# Altium project PCB_Project.PrjPcb
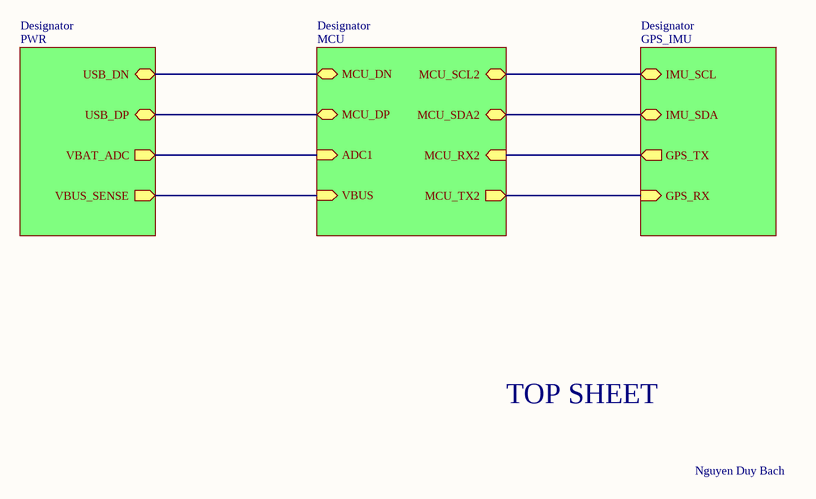
[diagram p0: Top.SchDoc]
4 sheets, 82 parts. Net scope: hierarchical (ports join the sheet entries above them; power ports are global).
Board file: Top.PcbDoc
Sheets:
  Top.SchDoc
    Designator = PWR.SchDoc
    Designator = MCU.SchDoc
    Designator = GPS_IMU.SchDoc

## Sheet Top.SchDoc
size A; SheetNumber: 1; SheetTotal: 4

### Sub-sheets
Designator = PWR: VBAT_ADC (out), VBUS_SENSE (out), USB_DP (bidir), USB_DN (bidir)
Designator = MCU: MCU_DN (bidir), MCU_DP (bidir), ADC1 (in), VBUS (in), MCU_SDA2 (bidir), MCU_SCL2 (bidir), MCU_TX2 (out), MCU_RX2 (in)
Designator = GPS_IMU: IMU_SCL (bidir), IMU_SDA (bidir), GPS_TX (out), GPS_RX (in)

### Nets
IMU_SCL: sheet Designator/MCU_SCL2, sheet Designator/IMU_SCL
IMU_SDA: sheet Designator/MCU_SDA2, sheet Designator/IMU_SDA
IO_A1: sheet Designator/VBAT_ADC, sheet Designator/ADC1
IO_A9: sheet Designator/VBUS_SENSE, sheet Designator/VBUS
RX2: sheet Designator/MCU_RX2, sheet Designator/GPS_TX
TX2: sheet Designator/MCU_TX2, sheet Designator/GPS_RX
USB_D_N: sheet Designator/USB_DN, sheet Designator/MCU_DN
USB_D_P: sheet Designator/USB_DP, sheet Designator/MCU_DP

### Notes on the sheet
- TOP SHEET
- Nguyen Duy Bach

## Sheet PWR.SchDoc
size A; SheetNumber: 4; SheetTotal: 4
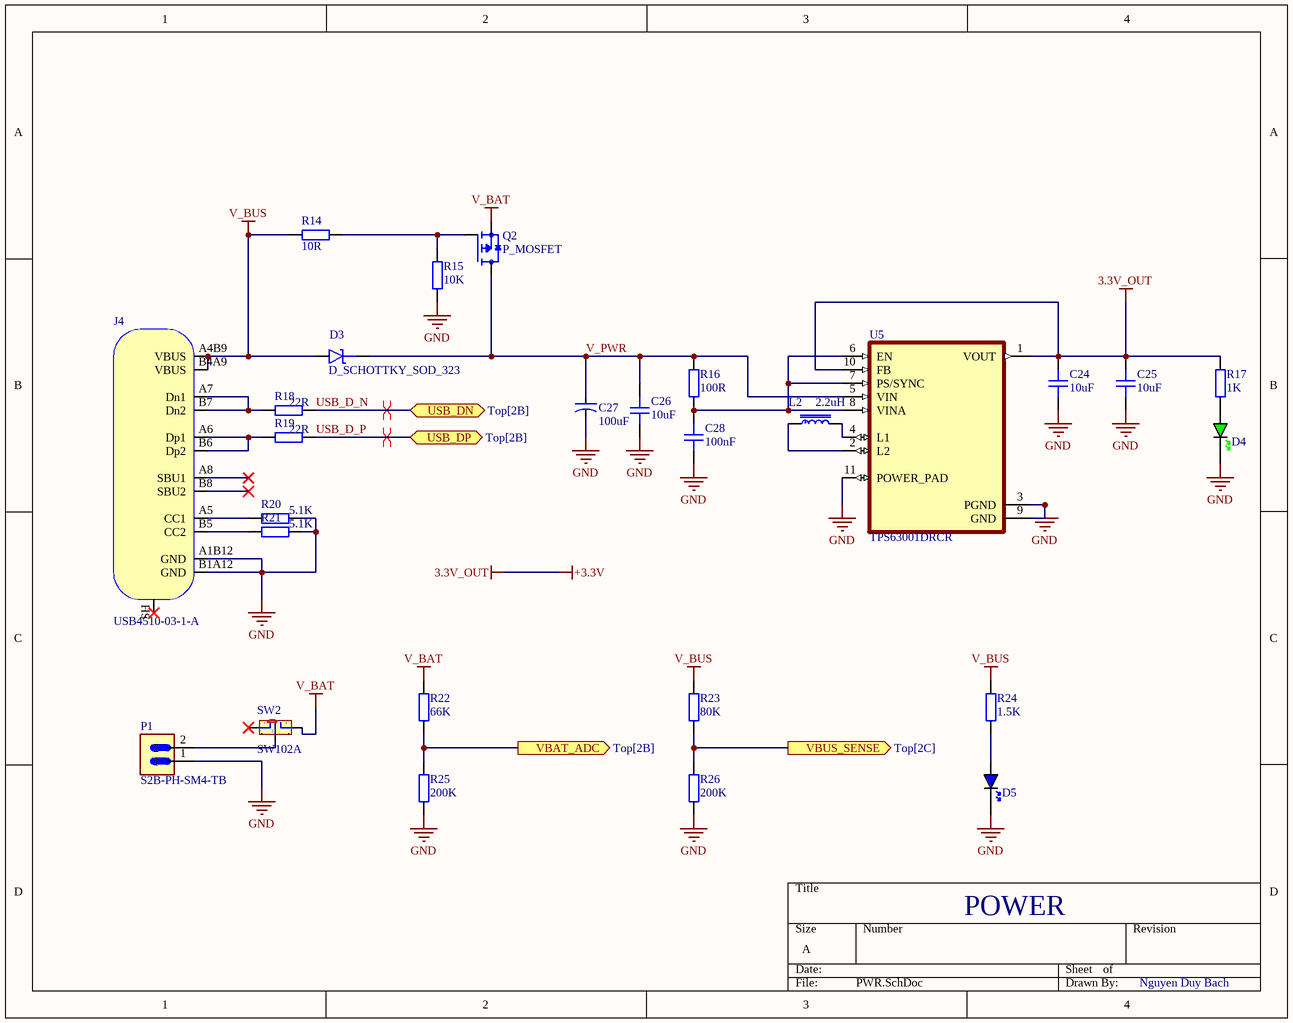
[diagram p1: PWR.SchDoc]

### Parts
C24  10uF  [CAP_1206]
C25  10uF  [CAP_1206]
C26  10uF  [CAP_1206]
C27  100uF  [CAP-ALU-SMD-6.3x7.7x2.2]
C28  100nF  [CAP_0603]
D3  D_SCHOTTKY_SOD_323  [SOD-323]
D4  GREEN  [LED_0805_GREEN]  (value not drawn)
D5  BLUE  [LED_0805_BLUE]  (value not drawn)
J4  USB4510-03-1-A  [USB4510-03-1-A]
L2  2.2uH  [INDC6060X300]
P1  S2B-PH-SM4-TB  [JST_S2B-PH-SM4-TB]
Q2  P_MOSFET  [P_MOSFET_SOT23]
R14  10R  [RES_0603]
R15  10K  [RES_0603]
R16  100R  [RES_1206]
R17  1K  [RES_0805]
R18  22R  [RES_0603]
R19  22R  [RES_0603]
R20  5.1K  [RES_0603]
R21  5.1K  [RES_0603]
R22  66K  [RES_0603]
R23  80K  [RES_0603]
R24  1.5K  [RES_0805]
R25  200K  [RES_0603]
R26  200K  [RES_0603]
SW2  SW102A  [SW102]
U5  TPS63001DRCR  [VREG_V62/16624-01YE]

### Ports
USB_DN (bidir, see Top[2B]), USB_DP (bidir, see Top[2B]), VBAT_ADC (out, see Top[2B]), VBUS_SENSE (out, see Top[2C])

### Nets
+3.3V: C24.2 C25.2 R17.2 U5.1(VOUT) U5.10(FB)  [also labelled 3.3V_OUT]  [project net IMU_VIN]
GND: C24.1 C25.1 C26.1 C27.2 C28.1 D4.K D5.K J4.A1B12(GND) J4.B1A12(GND) P1.1 R15.1 R20.1 R21.1 R25.1 R26.1 U5.3(PGND) U5.9(GND) U5.11(POWER_PAD)
V_BAT: Q2.2(S) R22.2 SW2.3
V_BUS: D3.A J4.A4B9(VBUS) J4.B4A9(VBUS) R14.2 R23.2 R24.2
IO_A1: R22.1 R25.2 ; port VBAT_ADC
IO_A9: R23.1 R26.2 ; port VBUS_SENSE
USB_D_N: R18.1 ; port USB_DN
USB_D_P: R19.1 ; port USB_DP
V_PWR: C26.2 C27.1 D3.K Q2.3(D) R16.2 U5.5(VIN)
NetC28_2: C28.2 R16.1 U5.6(EN) U5.7(PS/SYNC) U5.8(VINA)
NetD4_A: D4.A R17.1
NetD5_A: D5.A R24.1
NetJ4_A5: J4.A5(CC1) R20.2
NetJ4_A6: J4.A6(Dp1) J4.B6(Dp2) R19.2
NetJ4_A7: J4.A7(Dn1) J4.B7(Dn2) R18.2
NetJ4_B5: J4.B5(CC2) R21.2
NetL2_1: L2.1 U5.2(L2)
NetL2_2: L2.2 U5.4(L1)
NetP1_2: P1.2 SW2.2
NetQ2_1: Q2.1(G) R14.1 R15.2

Not connected (* = marked no-connect by the designer): J4 A8(SBU1)* B8(SBU2)* SH(SHIELD)*; SW2 1* 4 5

### Layout directives
differential pair: USB_D_N, USB_D_P

### Notes on the sheet
- POWER
- Nguyen Duy Bach

### Library data of the parts
C24-C26 = CAP_1206: Capacitor SMD 1206; Manufacturer: *; Manufacturer Part Number: *; Distributor Link: *; LCSC: *; Rating: *; Dielectric: *
C27 = CN-ALU-SMD: Polarized Capacitor (Axial); Published: 8-Jun-2000; LatestRevisionDate: 17-Jul-2002; LatestRevisionNote: Re-released for DXP Platform.; PackageReference: POLAR0.8; Publisher: Altium Limited
C28 = CAP_0603: Capacitor SMD 0603; Manufacturer: *; Manufacturer Part Number: *; Distributor Link: *; LCSC: *; Rating: *; Dielectric: *
D3 = D_SCHOTTKY_SOD_323: Diode Schottky SMD SOD-323
D4 = LED_0805_GREEN: LED 0805 GREEN SMD; Manufacturer: *; Manufacturer Part Number: *; Distributor Link: *; LCSC: *
D5 = LED_0805_BLUE: LED 0805 BLUE SMD; Manufacturer: *; Manufacturer Part Number: *; Distributor Link: *; LCSC: *
J4 = USB4510-03-1-A: USB Connector Type C SMT Mid-Mount 16 Pin; Manufacturer: GCT; Manufacturer Part Number: USB4510-03-1-A
L2 = CSAB0630-100M: SMD Inductor 10uH-20%-5A; MF: Codaca; SnapEDA_Link: https://www.snapeda.com/parts/CSAB0630-100M/Codaca/view-part/?ref=snap; Package: None; Value: *; MP: CSAB0630-100M; Check_prices: https://www.snapeda.com/parts/CSAB0630-100M/Codaca/view-part/?ref=eda
P1 = S2B-PH-SM4-TB: Connector Header Surface Mount, Right Angle 2 position 0.079 (2.00mm); MF: JST Sales; SnapEDA_Link: https://www.snapeda.com/parts/S2B-PH-SM4-TB/JST/view-part/?ref=snap; Package: None; Value: *; MP: S2B-PH-SM4-TB; Check_prices: https://www.snapeda.com/parts/S2B-PH-SM4-TB/JST/view-part/?ref=eda
Q2 = P_MOSFET: MOSFET, SOT-23, P, -30V, -4A, 0.065â„¦, 150Â°C; MF: Diotec Semiconductor; MP: MMFTP3401; SnapEDA_Link: https://www.snapeda.com/parts/MMFTP3401/Diotec/view-part/?ref=snap; Package: SOT-23 Diotec; Value: *; Check_prices: https://www.snapeda.com/parts/MMFTP3401/Diotec/view-part/?ref=eda
R14 R15 R18-R23 R25 R26 = RES_0603: Resistor SMD 0603; Manufacturer: *; Manufacturer Part Number: *; Distributor Link: *; LCSC: *
R16 = RES_1206: Resistor SMD 1206; Manufacturer: *; Manufacturer Part Number: *; Distributor Link: *; LCSC: *
R17 R24 = RES_0805: Resistor SMD 0805; Manufacturer: *; Manufacturer Part Number: *; Distributor Link: *; LCSC: *
SW2 = SW102A: Switch 102 on Broad; Value: Switch 102 On Board
U5 = TPS63001DRCR: 96% Buck-Boost Converter with 1.7A Current Switches, 3.3V fixed Output voltage in 3x3 QFN; MF: Texas Instruments; SnapEDA_Link: https://www.snapeda.com/parts/TPS63001DRCR/Texas+Instruments/view-part/?ref=snap; Package: VSON-10 Texas Instruments; Value: *; MP: TPS63001DRCR; Check_prices: https://www.snapeda.com/parts/TPS63001DRCR/Texas+Instruments/view-part/?ref=eda

## Sheet MCU.SchDoc
size A; SheetNumber: 2; SheetTotal: 4
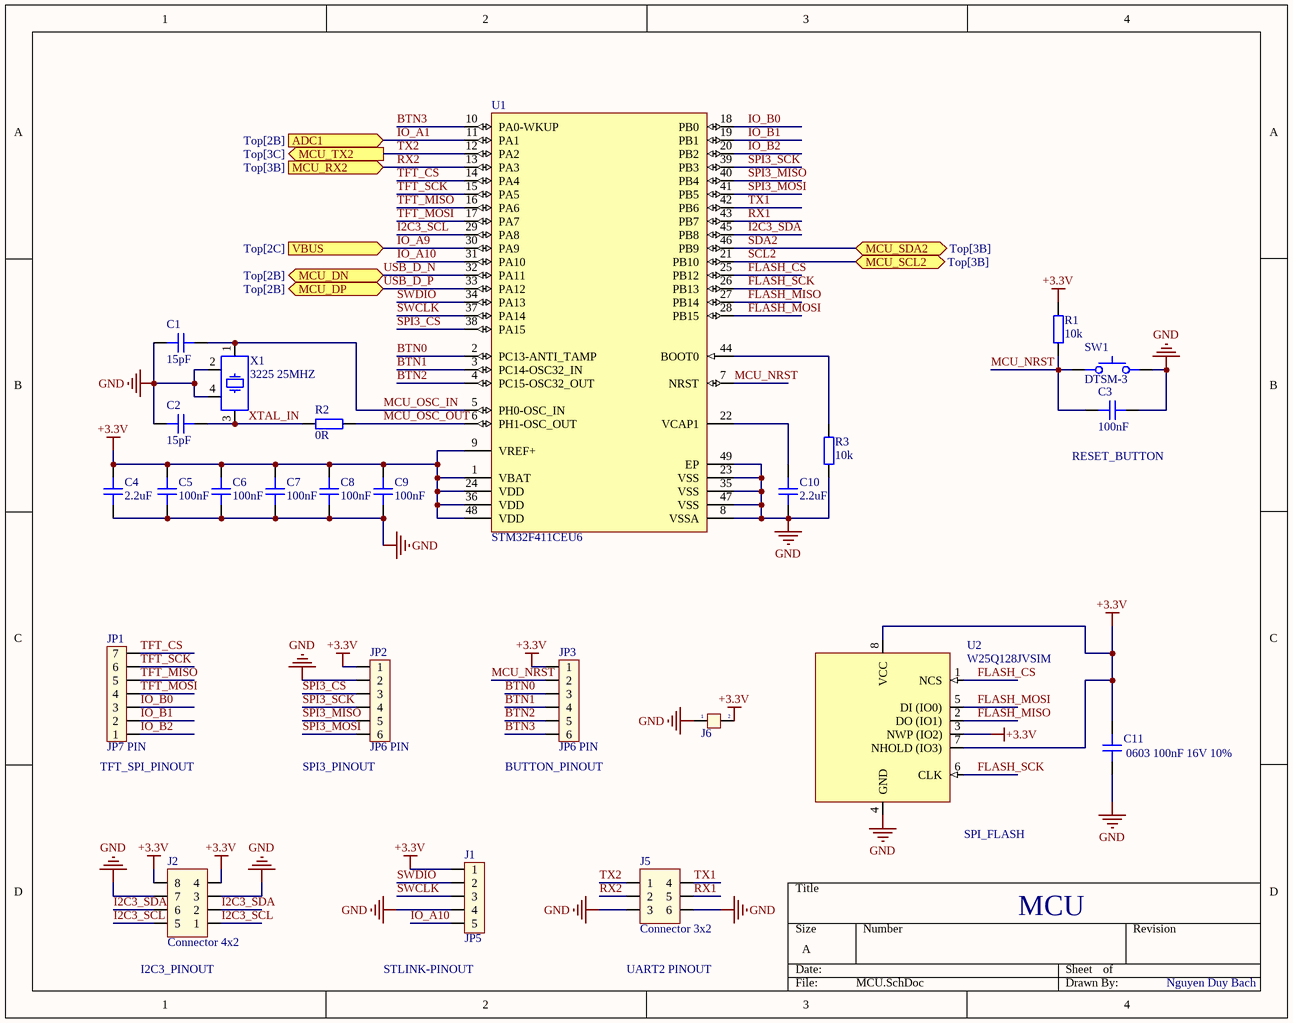
[diagram p2: MCU.SchDoc]

### Parts
C1  15pF  [CAP_0603]
C2  15pF  [CAP_0603]
C3  100nF  [CAP_0603]
C4  2.2uF  [CAP_0805]
C5  100nF  [CAP_0603]
C6  100nF  [CAP_0603]
C7  100nF  [CAP_0603]
C8  100nF  [CAP_0603]
C9  100nF  [CAP_0603]
C10  2.2uF  [CAP_0805]
C11  0603 100nF 16V 10%  [CAP_0603]
J1  JP5  [JP5]
J2  Connector 4x2  [JP4x2]
J5  Connector 3x2  [JP3x2]
J6  Jumper 2  [JP2]  (value not drawn)
JP1  JP7 PIN  [JP7]
JP2  JP6 PIN  [JP6]
JP3  JP6 PIN  [JP6]
R1  10k  [RES_0603]
R2  0R  [RES_0603]
R3  10k  [RES_0603]
SW1  DTSM-3  [DTSM-3]
U1  STM32F411CEU6  [STM-UFQFPN48_L]
U2  W25Q128JVSIM  [SOIC-8]
X1  3225 25MHZ  [XTAL_3225]

### Ports
ADC1 (in, see Top[2B]), MCU_DN (bidir, see Top[2B]), MCU_DP (bidir, see Top[2B]), MCU_RX2 (in, see Top[3B]), MCU_SCL2 (bidir, see Top[3B]), MCU_SDA2 (bidir, see Top[3B]), MCU_TX2 (out, see Top[3C]), VBUS (in, see Top[2C])

### Nets
+3.3V: C4.2 C5.2 C6.2 C7.2 C8.2 C9.2 C11.2 J1.1 J2.4 J2.8 J6.2 JP2.1 JP3.1 R1.2 U1.1(VBAT) U1.9(VREF+) U1.24(VDD) U1.36(VDD) U1.48(VDD) U2.3(NWP_(IO2)) U2.7(NHOLD_(IO3)) U2.8(VCC)  [project net IMU_VIN]
GND: C1.2 C2.2 C3.1 C4.1 C5.1 C6.1 C7.1 C8.1 C9.1 C10.1 C11.1 J1.4 J2.3 J2.7 J5.3 J5.6 J6.1 JP2.2 R3.1 SW1.2 U1.8(VSSA) U1.23(VSS) U1.35(VSS) U1.47(VSS) U1.49(EP) U2.4(GND) X1.2 X1.4
BTN0: JP3.3 U1.2(PC13-ANTI_TAMP)
BTN1: JP3.4 U1.3(PC14-OSC32_IN)
BTN2: JP3.5 U1.4(PC15-OSC32_OUT)
BTN3: JP3.6 U1.10(PA0-WKUP)
FLASH_CS: U1.25(PB12) U2.1(NCS)
FLASH_MISO: U1.27(PB14) U2.2(DO_(IO1))
FLASH_MOSI: U1.28(PB15) U2.5(DI_(IO0))
FLASH_SCK: U1.26(PB13) U2.6(CLK)
I2C3_SCL: J2.1 J2.5 U1.29(PA8)
I2C3_SDA: J2.2 J2.6 U1.45(PB8)
IO_A1: U1.11(PA1) ; port ADC1
IO_A9: U1.30(PA9) ; port VBUS
IO_A10: J1.5 U1.31(PA10)
IO_B0: JP1.3 U1.18(PB0)
IO_B1: JP1.2 U1.19(PB1)
IO_B2: JP1.1 U1.20(PB2)
MCU_NRST: C3.2 JP3.2 R1.1 SW1.1 U1.7(NRST)
MCU_OSC_IN: C1.1 U1.5(PH0-OSC_IN) X1.1
MCU_OSC_OUT: R2.1 U1.6(PH1-OSC_OUT)
RX1: J5.5 U1.43(PB7)
RX2: J5.2 U1.13(PA3) ; port MCU_RX2
SCL2: U1.21(PB10) ; port MCU_SCL2  [project net IMU_SCL]
SDA2: U1.46(PB9) ; port MCU_SDA2  [project net IMU_SDA]
SPI3_CS: JP2.3 U1.38(PA15)
SPI3_MISO: JP2.5 U1.40(PB4)
SPI3_MOSI: JP2.6 U1.41(PB5)
SPI3_SCK: JP2.4 U1.39(PB3)
SWCLK: J1.3 U1.37(PA14)
SWDIO: J1.2 U1.34(PA13)
TFT_CS: JP1.7 U1.14(PA4)
TFT_MISO: JP1.5 U1.16(PA6)
TFT_MOSI: JP1.4 U1.17(PA7)
TFT_SCK: JP1.6 U1.15(PA5)
TX1: J5.4 U1.42(PB6)
TX2: J5.1 U1.12(PA2) ; port MCU_TX2
USB_D_N: U1.32(PA11) ; port MCU_DN
USB_D_P: U1.33(PA12) ; port MCU_DP
XTAL_IN: C2.1 R2.2 X1.3
NetC10_2: C10.2 U1.22(VCAP1)
NetR3_2: R3.2 U1.44(BOOT0)

### Notes on the sheet
- (near C3) RESET_BUTTON
- (near JP1) TFT_SPI_PINOUT
- (near JP2) SPI3_PINOUT
- (near JP3) BUTTON_PINOUT
- (near U2) SPI_FLASH
- (near J2) I2C3_PINOUT
- (near J1) STLINK-PINOUT
- UART2 PINOUT
- MCU
- Nguyen Duy Bach

### Library data of the parts
C1-C3 C5-C9 C11 = CAP_0603: Capacitor SMD 0603; Manufacturer: *; Manufacturer Part Number: *; Distributor Link: *; LCSC: *; Rating: *; Dielectric: *
C4 C10 = CAP_0805: Capacitor SMD 0805; Manufacturer: *; Manufacturer Part Number: *; Distributor Link: *; LCSC: *; Rating: *; Dielectric: *
J2 = JP4x2: Value: Connector 4x2
J5 = JP3x2: Value: Connector 3x2
J6 = JP 2: Value: JP 2
JP1 = JP7: Value: JP7
JP2 JP3 = JP6: Value: JP7
R1-R3 = RES_0603: Resistor SMD 0603; Manufacturer: *; Manufacturer Part Number: *; Distributor Link: *; LCSC: *
SW1 = DTSM-3: Tactile Switch SMD SPST; Manufacturer: Diptronics; Manufacturer Part Number: DTSM-3
U1 = CMP-0243-00165-1: ARM Cortex-M4 32-bit MCU+FPU, 512 KB Flash, 128 KB RAM, 36 I/Os, 48-Pin UFQFPN, -40 to 85 degC, Tray; Operating Frequency(F) (Processor speed) (MHz): 100; FLASH Size (Prog) (kB): 512; Internal RAM Size (kB): 128; I/Os (High Current): 36; Supply Voltage(Vcc) min (V): 1.7; Package Reference: 48-Pin Ultra Thin Fine Pitch Quad Flat No-Lead, 7 x 7 x 0.6 mm Body, 0.5 mm Pitch, Exposed Pad; ComponentLink1Description: Manufacturer URL; ComponentLink1URL: http://www.st.com/; Packing: Tray; Package Description: UFQFPN48; Core: ARM Cortex-M4; ComponentLink2Description: Datasheet; ComponentLink2URL: http://www.st.com/st-web-ui/static/active/en/resource/technical/document/datasheet/DM00115249.pdf; DatasheetVersion: Rev. 6; Mounting Technology: Surface Mount
U2 = W25Q128JVSIM: 128M-BIT / SERIAL FLASH MEMORY WITH / DUAL/QUAD SPI & QPI & DTR SOIC-8; Manufacturer: Winbond; Manufacturer Part Number: W25Q128JVSIM
X1 = XTAL 4 Pin: Crystal Oscillator; Distributor Link: *

## Sheet GPS_IMU.SchDoc: BACH
size A; SheetNumber: 3; SheetTotal: 4
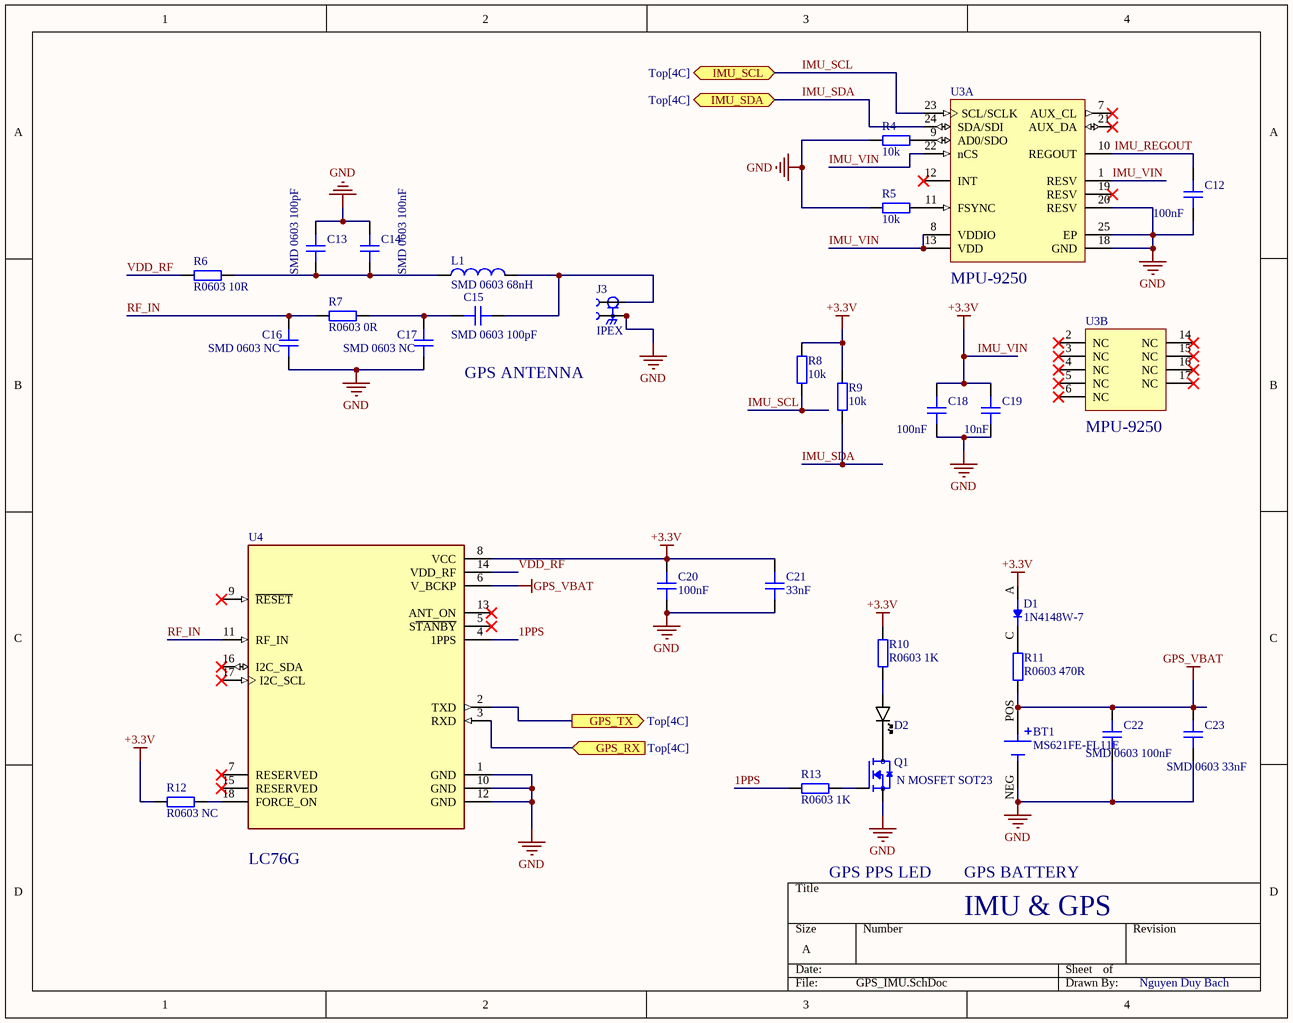
[diagram p3: GPS_IMU.SchDoc]

### Parts
BT1  MS621FE-FL11E  [BAT_MS621FE-FL11E]
C12  100nF  [CAP_0603]
C13  SMD 0603 100pF  [CAP_0603]
C14  SMD 0603 100nF  [CAP_0603]
C15  SMD 0603 100pF  [CAP_0603]
C16  SMD 0603 NC  [NC_0603]
C17  SMD 0603 NC  [NC_0603]
C18  100nF  [CAP_0603]
C19  10nF  [CAP_0603]
C20  100nF  [CAP_0603]
C21  33nF  [CAP_0603]
C22  SMD 0603 100nF  [CAP_0603]
C23  SMD 0603 33nF  [CAP_0603]
D1  1N4148W-7  [SOD3715X135N]
D2  BLUE  [LED_0805]  (value not drawn)
J3  IPEX  [IPEX_20279-001E-03]
L1  SMD 0603 68nH  [0603 INDUCTOR]
Q1  N MOSFET SOT23  [SOT95P237X112-3N]
R4  10k  [RES_0603]
R5  10k  [RES_0603]
R6  R0603 10R  [RES_0603]
R7  R0603 0R  [RES_0603]
R8  10k  [RES_0603]
R9  10k  [RES_0603]
R10  R0603 1K  [RES_0603]
R11  R0603 470R  [RES_0603]
R12  R0603 NC  [NC_0603]
R13  R0603 1K  [RES_0603]
U3  MPU-9250  [INSE-QFN-24-1700X1540TP_M]  (parts A,B of 2)
U4  LC76G  [XCVR_LC76G]

### Ports
GPS_RX (in, see Top[4C]), GPS_TX (out, see Top[4C]), IMU_SCL (bidir, see Top[4C]), IMU_SDA (bidir, see Top[4C])

### Nets
GND: BT1.NEG C12.1 C13.2 C14.2 C16.2 C17.2 C18.1 C19.1 C20.1 C21.1 C22.1 C23.1 J3.2(GROUND) J3.3(GROUND) Q1.2(S) R4.2 R5.2 U3.18(GND) U3.20(RESV) U3.25(EP) U4.1(GND) U4.10(GND) U4.12(GND)
GPS_VBAT: BT1.POS C22.2 C23.2 R11.1 U4.6(V_BCKP)
IMU_VIN: C18.2 C19.2 C20.2 C21.2 D1.A R8.2 R9.2 R10.2 R12.1 U3.1(RESV) U3.8(VDDIO) U3.13(VDD) U3.22(nCS) U4.8(VCC)  [also labelled +3.3V]
1PPS: R13.2 U4.4(1PPS)
IMU_REGOUT: C12.2 U3.10(REGOUT)
IMU_SCL: R8.1 U3.23(SCL/SCLK) ; port IMU_SCL
IMU_SDA: R9.1 U3.24(SDA/SDI) ; port IMU_SDA
RF_IN: C16.1 R7.1 U4.11(RF_IN)
RX2: U4.2(TXD) ; port GPS_TX
TX2: U4.3(RXD) ; port GPS_RX
VDD_RF: R6.1 U4.14(VDD_RF)
NetC13_1: C13.1 C14.1 L1.1 R6.2
NetC15_1: C15.1 C17.1 R7.2
NetC15_2: C15.2 J3.1(SIGNAL) L1.2
NetD1_C: D1.C(K) R11.2
NetD2_A: D2.A R10.1
NetD2_K: D2.K Q1.3(D)
NetQ1_1: Q1.1(G) R13.1
NetR4_1: R4.1 U3.9(AD0/SDO)
NetR5_1: R5.1 U3.11(FSYNC)
NetR12_2: R12.2 U4.18(FORCE_ON)

Not connected (* = marked no-connect by the designer): U3 2(NC)* 3(NC)* 4(NC)* 5(NC)* 6(NC)* 7(AUX_CL)* 12(INT)* 14(NC)* 15(NC)* 16(NC)* 17(NC)* 19(RESV)* 21(AUX_DA)*; U4 5(S~{TANBY})* 7(RESERVED)* 9(~{RESET})* 13(ANT_ON)* 15(RESERVED)* 16(I2C_SDA)* 17(I2C_SCL)*

### Notes on the sheet
- GPS ANTENNA
- GPS PPS LED
- GPS BATTERY
- IMU & GPS
- Nguyen Duy Bach

### Library data of the parts
BT1 = MS621FE-FL11E: Coin, 6.8mm 3 V Lithium Battery Rechargeable (Secondary) 5.5mAh; MF: Seiko Instruments; Value: *; Purchase-URL: https://pricing.snapeda.com/search/part/MS621FE-FL11E/?ref=eda; Package: QFP-128 Seiko; Availability: In Stock; Check_prices: https://www.snapeda.com/parts/MS621FE-FL11E/Seiko+Instruments/view-part/?ref=eda; Price: None; SnapEDA_Link: https://www.snapeda.com/parts/MS621FE-FL11E/Seiko+Instruments/view-part/?ref=snap; MP: MS621FE-FL11E
C12-C23 = CAP_0603: Capacitor SMD 0603; Manufacturer: *; Manufacturer Part Number: *; Distributor Link: *; LCSC: *; Rating: *; Dielectric: *
D1 = 1N4148W-7: Diode Standard 100 V 300mA (DC) Surface Mount SOD-123; MF: Diodes Inc.; SnapEDA_Link: https://www.snapeda.com/parts/1N4148W-7/Diodes+Inc./view-part/?ref=snap; Package: SOD-123 Fairchild Semiconductor; MP: 1N4148W-7; Check_prices: https://www.snapeda.com/parts/1N4148W-7/Diodes+Inc./view-part/?ref=eda; Purchase-URL: https://pricing.snapeda.com/search/part/1N4148W-7/?ref=eda; Price: None; Value: *; Availability: In Stock
D2 = LED_0805: LED 0805 BLUE SMD; Manufacturer: *; Manufacturer Part Number: *; Distributor Link: *; LCSC: *
J3 = IPEX: 1 POS Vertical SMD Small form factor with big performance through 6 GHz connector,MHF, RF, micro-coaxial MHF I Receptacle; MF: I-PEX; MP: 20279-001E-03; SnapEDA_Link: https://www.snapeda.com/parts/20279-001E-03/I-PEX/view-part/?ref=snap; Package: None; Value: *; Check_prices: https://www.snapeda.com/parts/20279-001E-03/I-PEX/view-part/?ref=eda
L1 = INDUCTOR_0603: Inductor with 0603 (1608); MP: LQW18AS22NG0CD; MF: Murata; Purchase-URL: https://pricing.snapeda.com/search/part/LQW18AS22NG0CD/?ref=eda; Value: *; Availability: Warning; Package: 1608 Murata; SnapEDA_Link: https://www.snapeda.com/parts/LQW18AS22NG0CD/Murata/view-part/4476690/?ref=snap; Price: None; Check_prices: https://www.snapeda.com/parts/LQW18AS22NG0CD/Murata/view-part/4476690/?ref=eda
Q1 = SI2306BDS-T1-GE3: N-Channel 30 V 3.16A (Ta) 750mW (Ta) Surface Mount SOT-23-3 (TO-236); MF: Vishay Siliconix; SnapEDA_Link: https://www.snapeda.com/parts/SI2306BDS-T1-GE3/Vishay/view-part/?ref=snap; Package: SOT-23-3 Vishay Siliconix; Value: *; MP: SI2306BDS-T1-GE3; Check_prices: https://www.snapeda.com/parts/SI2306BDS-T1-GE3/Vishay/view-part/?ref=eda
R4-R13 = RES_0603: Resistor SMD 0603; Manufacturer: *; Manufacturer Part Number: *; Distributor Link: *; LCSC: *
U3 = CMP-2100-03657-1: 9-axis MotionTracking device, 2.4 to 3,6 V, -40 to 85 degC, 24-Pin QFN, RoHS, Tape and Reel; Manufacturer: InvenSense; Max Supply Voltage: 3.6V; Min Supply Voltage: 2.4V; Package Reference: QFN-24; Package Quantity: 1; Datasheet Version: Rev. 1.0, 01/2014; Case/Package: QFN; Package Description: 24-Pin Quad Flat No-lead Package, Body 3 x 3 mm, Pitch 0.4 mm; Datasheet URL: http://datasheet.octopart.com/MPU-9250-InvenSense-datasheet-21859386.pdf; RoHSCompliant: true; Max Operating Temperature: 85degC; Height: 1mm; Mount: SurfaceMount; Manufacturer URL: http://www.invensense.com/; Width: 3.1mm; Min Operating Temperature: -40degC; Length: 3.1mm
U4 = LC76G: MF: Quectel; Package: None; Price: None; Value: *; MP: LC76G; Availability: Unavailable

## Nets that join several sheets
GND: PWR (18 pins), MCU (28 pins), GPS_IMU (23 pins)
IMU_VIN: PWR (5 pins), MCU (22 pins), GPS_IMU (14 pins)
IMU_SCL: MCU (U1.21), GPS_IMU (R8.1 U3.23)
IMU_SDA: MCU (U1.46), GPS_IMU (R9.1 U3.24)
IO_A1: PWR (R22.1 R25.2), MCU (U1.11)
IO_A9: PWR (R23.1 R26.2), MCU (U1.30)
RX2: MCU (J5.2 U1.13), GPS_IMU (U4.2)
TX2: MCU (J5.1 U1.12), GPS_IMU (U4.3)
USB_D_N: PWR (R18.1), MCU (U1.32)
USB_D_P: PWR (R19.1), MCU (U1.33)